# EAGLE design testbed (EAGLE 6.4)
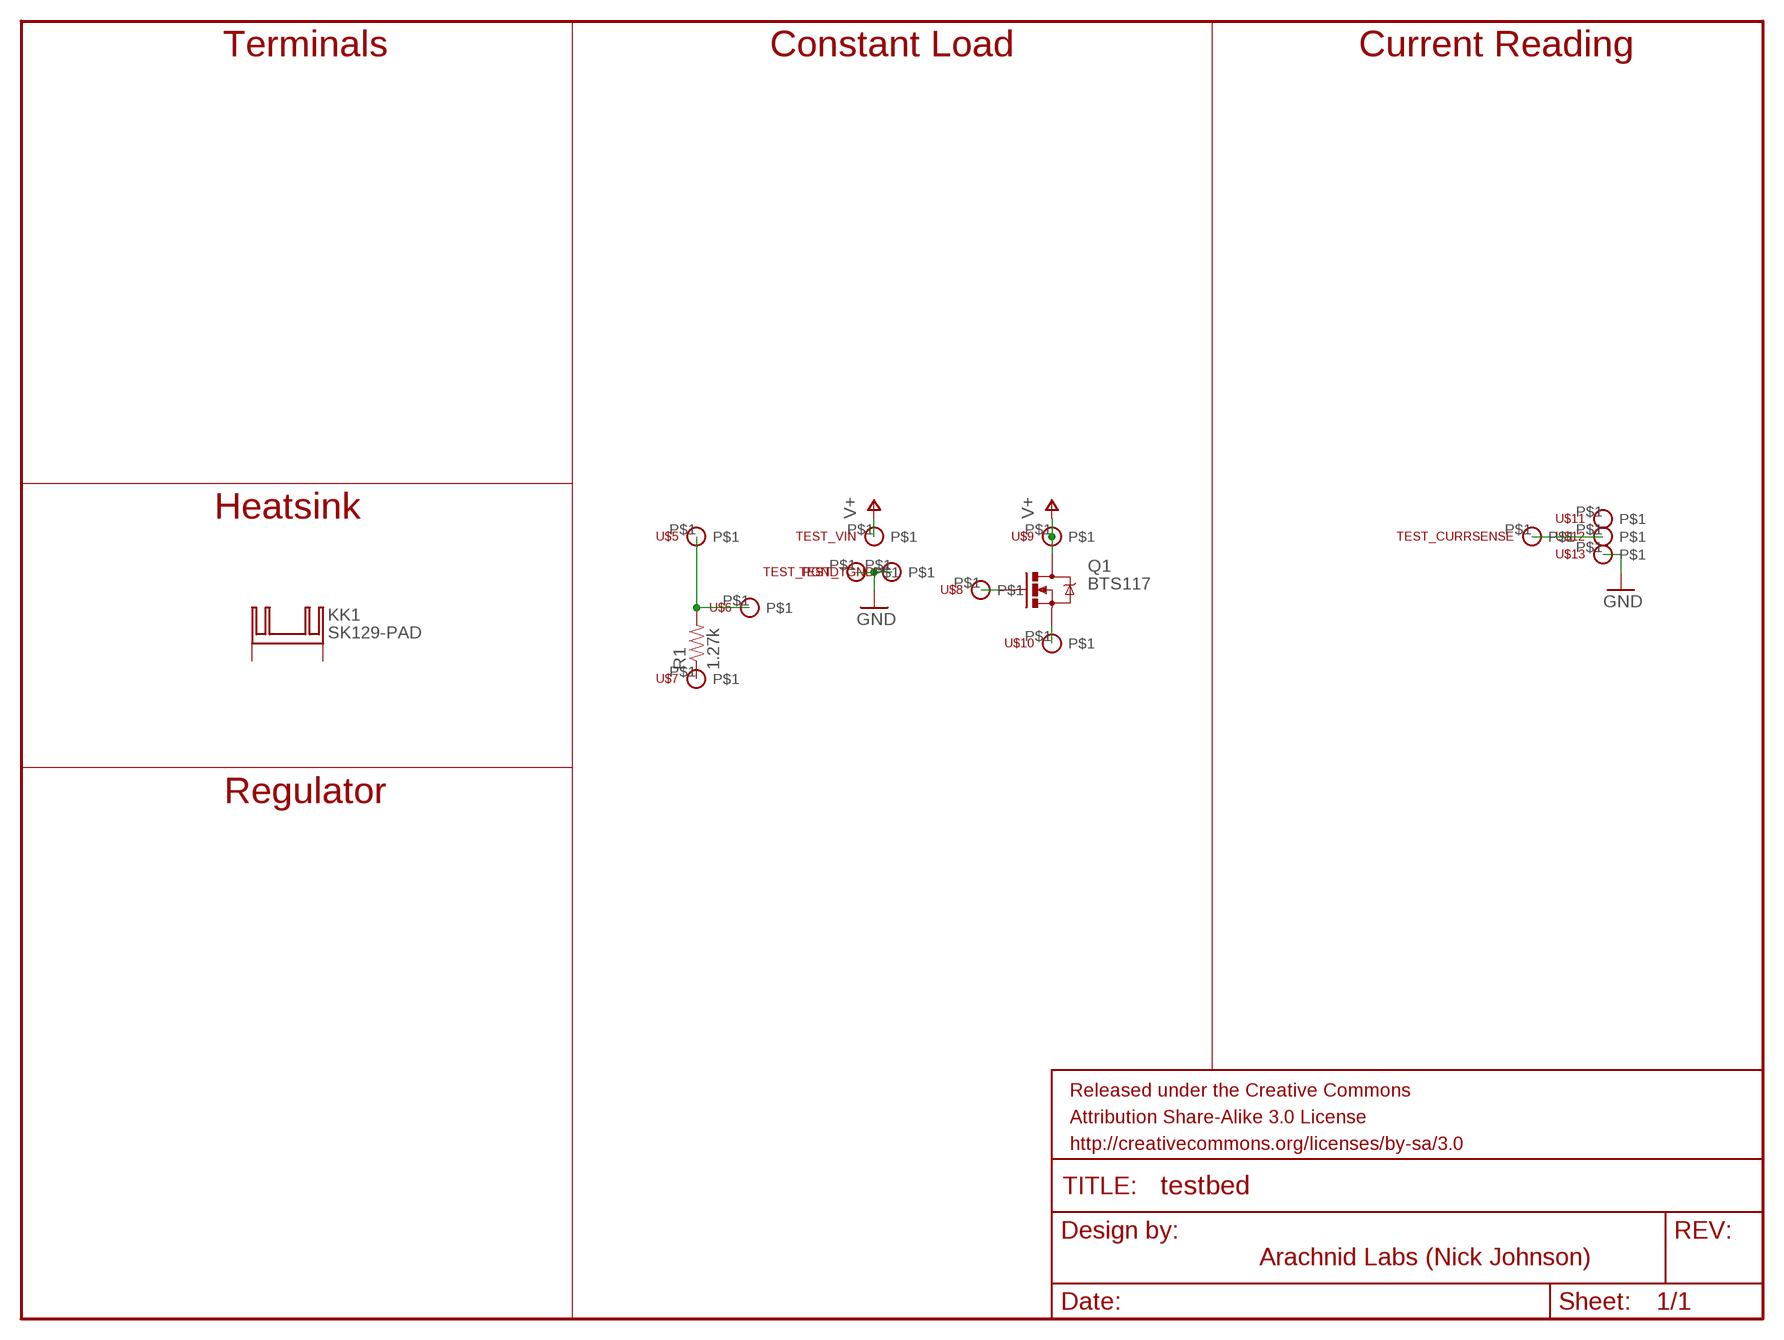
[diagram p0: schematic, sheet 1]

## Parts
KK1  SK129-PAD  [SK129]
Q1  BTS117  MOSFET-NCHANNELPTH2  [TO220V]
R1  1.27k  RESISTOR0805-RES  [0805]
TEST_CURRSENSE  TEST_POINT  [TEST_POINT]
TEST_PGND  TEST_POINT  [TEST_POINT]
TEST_TGND  TEST_POINT  [TEST_POINT]
TEST_VIN  TEST_POINT  [TEST_POINT]
U$5  POGOPIN1.02  [POGOPIN-1.02]
U$6  POGOPIN1.02  [POGOPIN-1.02]
U$7  POGOPIN1.02  [POGOPIN-1.02]
U$8  POGOPIN1.02  [POGOPIN-1.02]
U$9  POGOPIN1.02  [POGOPIN-1.02]
U$10  POGOPIN1.02  [POGOPIN-1.02]
U$11  POGOPIN1.02  [POGOPIN-1.02]
U$12  POGOPIN1.02  [POGOPIN-1.02]
U$13  POGOPIN1.02  [POGOPIN-1.02]

## Nets
GND: TEST_PGND.P$1 TEST_TGND.P$1 U$13.P$1
N$1: Q1.1(G) U$8.P$1
N$2: TEST_CURRSENSE.P$1 U$12.P$1
N$3: Q1.3(S) U$10.P$1
N$8: R1.2 U$5.P$1 U$6.P$1
N$9: R1.1 U$7.P$1
V+: Q1.2(D) TEST_VIN.P$1 U$9.P$1
Unconnected: KK1.A2,5(K) KK1.B2,5(K) U$11.P$1

## Notes on the sheet
- Terminals | Constant Load | Current Reading
- Heatsink
- Regulator
- Arachnid Labs (Nick Johnson)

## Library data of the parts
KK1 = nickparts:SK129-PAD: HEATSINK manufacturer Fischer/distributor Buerklin
Q1 = SparkFun-DiscreteSemi:MOSFET-NCHANNEL: Generic NMOS footprint
R1 = SparkFun-Passives:RESISTOR: Resistor Basic schematic elements and footprints for 0603, 1206, and PTH resistors.
TEST_CURRSENSE TEST_PGND TEST_TGND TEST_VIN = nickparts:TEST_POINT
U$5-U$13 = nickparts:POGOPIN

## Board
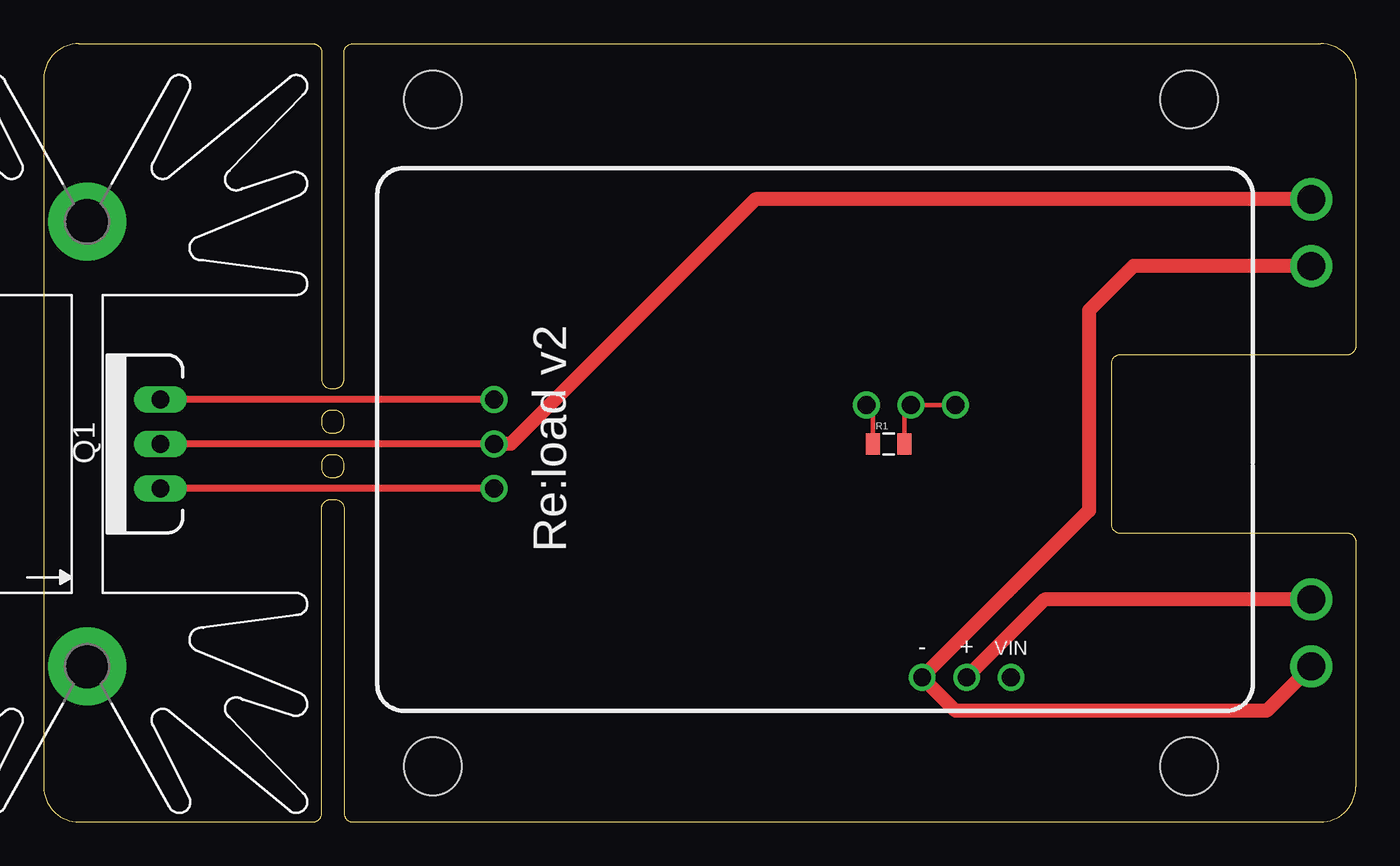
[diagram p1: board, top side]
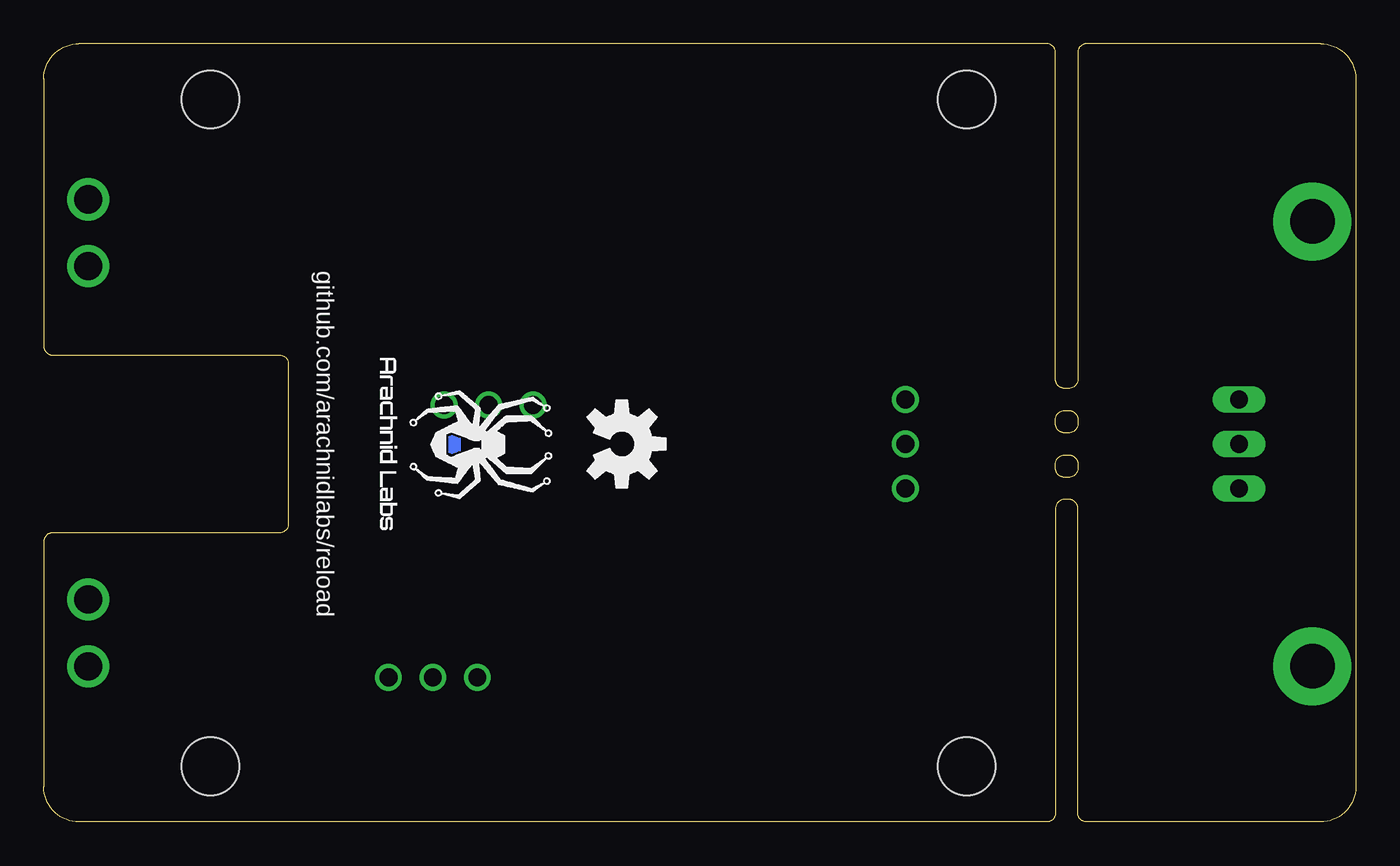
[diagram p2: board, bottom side, seen from below]

Size 74.93 x 44.45 mm. Coordinates in mm from the lower left corner, seen from the top.
Outline: 0,21.59 0,2 arc90 2,0 15.38,0 arc90 15.88,0.5 15.88,17.91 arc-90 16.38,18.41 16.64,18.41 arc-90 17.14,17.91 17.14,0.5 arc90 17.64,0 72.93,0 arc90 74.93,2 74.93,16.01 arc90 74.43,16.51 61.46,16.51 arc-90 60.96,17.01 60.96,26.17 arc-90 61.46,26.67 74.43,26.67 arc90 74.93,27.17 74.93,42.45 arc90 72.93,44.45 17.64,44.45 arc90 17.14,43.95 17.14,25.27 arc-90 16.64,24.77 16.51,24.77 16.38,24.77 arc-90 15.88,25.27 15.88,43.95 arc90 15.38,44.45 2,44.45 arc90 0,42.45 0,21.59
Outline: 15.88,23 15.88,22.73 arc90 16.38,22.23 16.64,22.23 arc90 17.14,22.73 17.14,23 arc90 16.64,23.5 16.38,23.5 arc90 15.88,23
Outline: 16.64,20.95 16.38,20.95 arc90 15.88,20.45 15.88,20.18 arc90 16.38,19.68 16.64,19.68 arc90 17.14,20.18 17.14,20.45 arc90 16.64,20.95
Copper layers (1*16): Top 0.035mm / dielectric 1.5mm / Bottom 0.035mm
Design rules "Fusion_eagle_rule_v1.1": minimum track width 6mil, minimum drill 12mil, track to track 6mil, track to pad 6mil, pad to pad 6mil, via to via 6mil, smd to smd 0mil, copper to edge 10mil, drill to drill 10mil, minimum pad ring 10mil, minimum via ring 6mil, stop-mask expansion 2mil, vias tented up to drill 100mil, thermal gap 10mil

### Footprints (pad centres in the part's own frame; a part is rotated, then mirrored left to right if it is on the bottom)
SK129 = drill 2.54 pad 4.445: A2,5 -12.7,-0.889; B2,5 12.7,-0.889
TO220V = drill 1.016 long: 1 -2.54,0; 2 0,0; 3 2.54,0
0805 = smd 0.8 x 1.2: 1 -0.9,0; 2 0.9,0
TEST_POINT = drill 1.6: P$1 0,0
STAND-OFF = hole 3.302: 0,0
POGOPIN-1.02 = drill 1.02: P$1 0,0

### Placement (x,y rotation side)
KK1  1.59,21.59 90 top
Q1  6.67,21.59 90 top
R1  48.26,21.59 0 top
TEST_CURRSENSE  72.39,12.7 0 top
TEST_PGND  72.39,31.75 0 top
TEST_TGND  72.39,8.89 0 top
TEST_VIN  72.39,35.56 0 top
U$1  [STAND-OFF]  22.23,41.27 0 top
U$2  [ARACHNID_LABS_LOGO_SM]  50.8,21.59 270 bottom
U$3  [OSHW-LOGO-M]  41.91,21.59 270 bottom
U$4  [STAND-OFF]  22.23,3.17 0 top
U$5  52.07,23.81 0 top
U$6  49.53,23.81 0 top
U$7  46.99,23.81 0 top
U$8  25.72,19.05 0 top
U$9  25.72,21.59 0 top
U$10  25.72,24.13 0 top
U$11  55.24,8.26 0 top
U$12  52.7,8.26 0 top
U$13  50.16,8.26 0 top
U$14  [STAND-OFF]  65.41,41.27 0 top
U$15  [STAND-OFF]  65.41,3.17 0 top

### Tracks (layer width: path | path; a pad name or v marks a point on that pad's centre or on a via)
GND
  Top 0.813: TEST_TGND.P$1 69.85,6.35 52.07,6.35 U$13.P$1 59.69,17.78 59.69,29.21 62.23,31.75 TEST_PGND.P$1
N$1
  Top 0.406: U$8.P$1 Q1.1
N$2
  Top 0.813: TEST_CURRSENSE.P$1 57.15,12.7 U$12.P$1
N$3
  Top 0.406: U$10.P$1 Q1.3
N$8
  Top 0.254: R1.2 49.16,23.44 U$6.P$1 U$5.P$1
N$9
  Top 0.254: R1.1 47.36,23.44 U$7.P$1
V+
  Top 0.406: U$9.P$1 Q1.2
  Top 0.813: TEST_VIN.P$1 40.64,35.56 26.67,21.59 U$9.P$1

### Text on the board
tNames: Re:load v2 | - | + | VIN
bNames: github.com/arachnidlabs/reload